# EAGLE design rs-485-multiplier-v2-x8 (EAGLE 8.7.0)
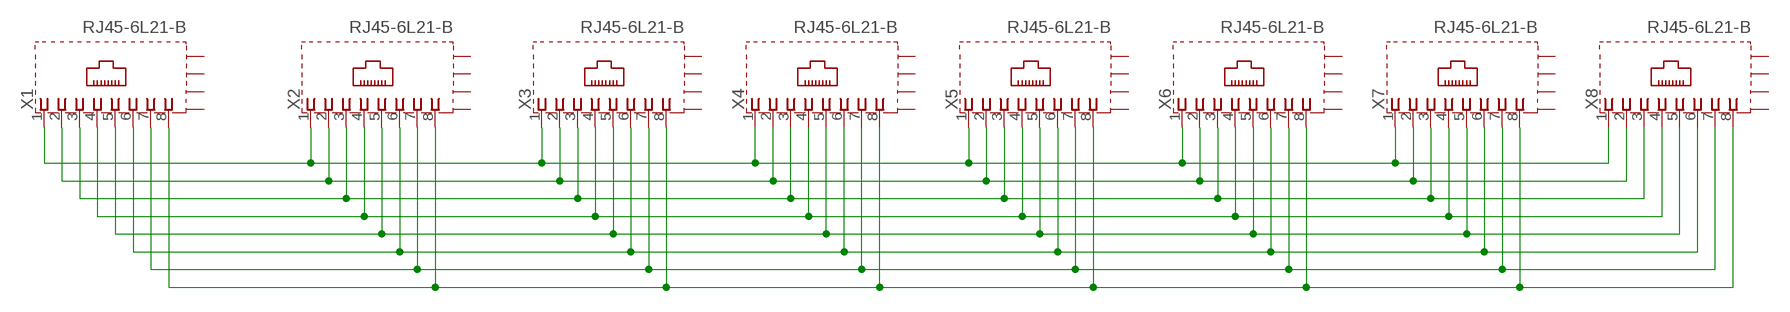
[diagram p0: schematic, sheet 1]

## Parts
X1  RJ45-6L21-B  [RJ45-SHIELD1]
X2  RJ45-6L21-B  [RJ45-SHIELD1]
X3  RJ45-6L21-B  [RJ45-SHIELD1]
X4  RJ45-6L21-B  [RJ45-SHIELD1]
X5  RJ45-6L21-B  [RJ45-SHIELD1]
X6  RJ45-6L21-B  [RJ45-SHIELD1]
X7  RJ45-6L21-B  [RJ45-SHIELD1]
X8  RJ45-6L21-B  [RJ45-SHIELD1]

## Nets
N$1: X1.1 X2.1 X3.1 X4.1 X5.1 X6.1 X7.1 X8.1
N$2: X1.2 X2.2 X3.2 X4.2 X5.2 X6.2 X7.2 X8.2
N$3: X1.3 X2.3 X3.3 X4.3 X5.3 X6.3 X7.3 X8.3
N$4: X1.4 X2.4 X3.4 X4.4 X5.4 X6.4 X7.4 X8.4
N$5: X1.5 X2.5 X3.5 X4.5 X5.5 X6.5 X7.5 X8.5
N$6: X1.6 X2.6 X3.6 X4.6 X5.6 X6.6 X7.6 X8.6
N$7: X1.7 X2.7 X3.7 X4.7 X5.7 X6.7 X7.7 X8.7
N$8: X1.8 X2.8 X3.8 X4.8 X5.8 X6.8 X7.8 X8.8
Unconnected: X1.S1(S) X1.S2(S) X1.S3(S) X1.S4(S) X2.S1(S) X2.S2(S) X2.S3(S) X2.S4(S) X3.S1(S) X3.S2(S) X3.S3(S) X3.S4(S) X4.S1(S) X4.S2(S) X4.S3(S) X4.S4(S) X5.S1(S) X5.S2(S) X5.S3(S) X5.S4(S) X6.S1(S) X6.S2(S) X6.S3(S) X6.S4(S) X7.S1(S) X7.S2(S) X7.S3(S) X7.S4(S) X8.S1(S) X8.S2(S) X8.S3(S) X8.S4(S)

## Library data of the parts
X1-X8 = con-tycoelectronics:RJ45*2: RJ45 Low Profile Shield Type 2 For all RJ45 L, LC, LCT and X Series Models Source: www.tycoelectronics.com .. ENG_DS_1654001_1099_RJ_L_0507.pdf; OC_FARNELL: unknown; OC_NEWARK: unknown

## Board
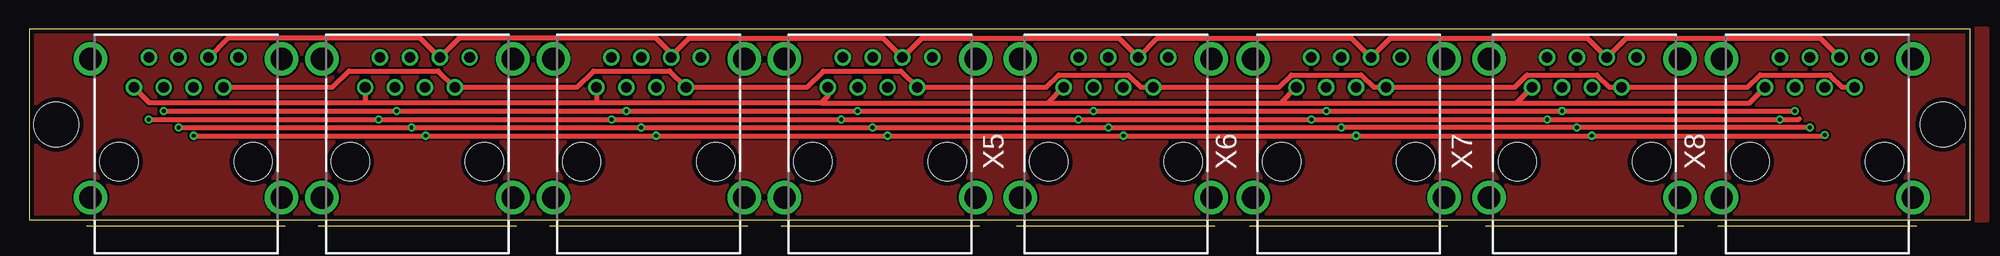
[diagram p1: board, top side]
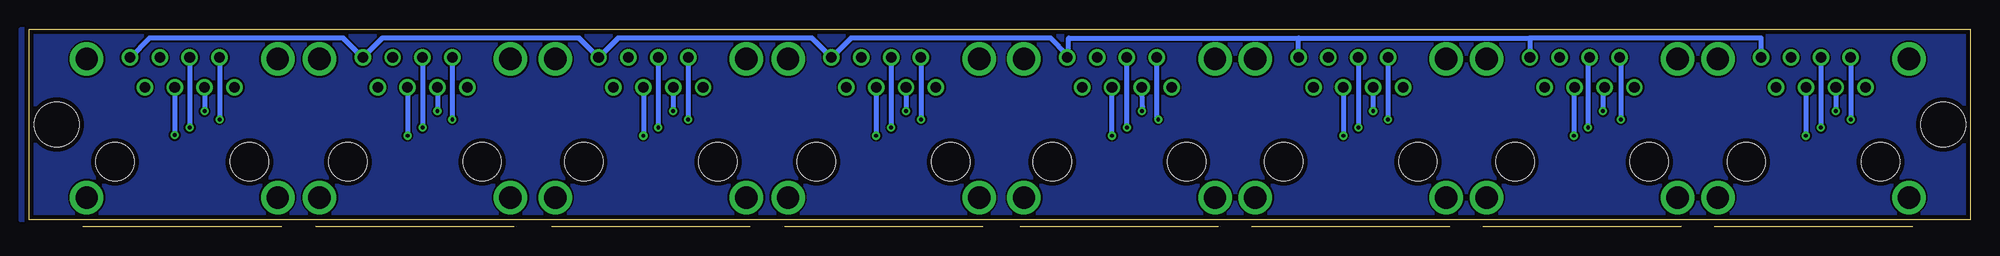
[diagram p2: board, bottom side, seen from below]

Size 165.15 x 16.25 mm. Coordinates in mm from the lower left corner, seen from the top.
Outline: 0,0 165.15,0 165.15,16.25 0,16.25 0,0
Copper layers (1*16): Top 0.0356mm / dielectric 1.5011mm / Bottom 0.0356mm
Design rules "LaenPCBOrder": minimum track width 6mil, minimum drill 13mil, track to track 6mil, track to pad 6mil, pad to pad 6mil, via to via 6mil, smd to smd 6mil, copper to edge 15mil, drill to drill 6mil, minimum pad ring 7mil, minimum via ring 7mil, stop-mask expansion 4mil, vias tented up to drill 0mil, thermal gap 10mil
Holes 3.81 mm at 2.29,8.13 162.81,8.13

### Footprints (pad centres in the part's own frame; a part is rotated, then mirrored left to right if it is on the bottom)
RJ45-SHIELD1 = drill 0.9 pad 1.4: 1 -4.445,6.35; 2 -3.175,8.89; 3 -1.905,6.35; 4 -0.635,8.89; 5 0.635,6.35; 6 1.905,8.89; 7 3.175,6.35; 8 4.445,8.89 | drill 1.9 pad 2.5: S1 -8.128,-3.048; S2 8.128,-3.048; S3 -8.128,8.76; S4 8.128,8.76 | hole 3.251: -5.715,0; 5.715,0

### Placement (x,y rotation side)
X1  72.39,4.95 0 top
X2  52.7,4.95 0 top
X3  33.02,4.95 0 top
X4  13.33,4.95 0 top
X5  92.46,4.95 0 top
X6  112.27,4.95 0 top
X7  132.33,4.95 0 top
X8  152.15,4.95 0 top

### Tracks (layer width: path | path; a pad name or v marks a point on that pad's centre or on a via)
GND
  pour Top: 0,16.26 0,0 166.62,0 166.62,16.26
  pour Bottom: 0,16.26 0,0 165.86,0 165.86,16.26
N$1
  Top 0.406: X1.1 67.95,10.54 67.37,9.97 | 67.37,9.97 48.26,9.97 | 48.26,9.97 28.45,9.97 | 28.45,9.97 10.22,9.97 X4.1 | X2.1 48.26,9.97 | X3.1 28.58,10.1 28.45,9.97 | 67.37,9.97 86.68,9.97 | 86.68,9.97 X5.1 | 86.68,9.97 106.49,9.97 | 106.49,9.97 X6.1 | 106.49,9.97 126.56,9.97 | 126.56,9.97 X7.1 | 126.56,9.97 146.37,9.97 X8.1
N$2  (via drill 0.33)
  Top 0.406: v10.16,8.57 v29.72,8.57 v49.53,8.57 v69.09,8.57 v89.28,8.57 v109.09,8.57 v129.16,8.57 v148.97,8.57 150.56,8.57 150.62,8.64
  Bottom 0.406: X4.2 v10.16,8.57 | v69.09,8.57 69.22,8.57 X1.2 | X3.2 29.72,13.84 v29.72,8.57 | X2.2 v49.53,8.57 | X5.2 89.28,8.64 89.22,8.57 v89.28,8.57 | X6.2 v109.09,8.57 | X8.2 v148.97,8.57 | X7.2 v129.16,8.57
N$3  (via drill 0.33)
  Top 0.406: v11.43,9.27 v31.24,9.27 v50.8,9.27 v70.48,9.27 v90.55,9.27 v110.36,9.27 v130.43,9.27 v150.24,9.27
  Bottom 0.406: X4.3 v11.43,9.27 | v70.48,9.27 70.42,9.65 X1.3 | X3.3 31.24,11.3 v31.24,9.27 | X2.3 v50.8,9.27 | X5.3 v90.55,9.27 | X6.3 v110.36,9.27 | X8.3 v150.24,9.27 | X7.3 v130.43,9.27
N$4  (via drill 0.33)
  Top 0.406: v12.7,7.87 v32.51,7.87 v52.07,7.87 v71.76,7.87 v91.82,7.87 v111.63,7.87 v131.7,7.87 v151.51,7.87
  Bottom 0.406: X4.4 v12.7,7.87 | v71.76,7.87 X1.4 | X3.4 32.51,13.84 v32.51,7.87 | X2.4 v52.07,7.87 | X5.4 v91.82,7.87 91.82,7.81 | X6.4 v111.63,7.87 | X8.4 v151.51,7.87 | X7.4 v131.7,7.87
N$5  (via drill 0.33)
  Top 0.406: v13.97,7.18 v33.72,7.18 v53.34,7.18 v73.03,7.18 v93.09,7.18 v112.9,7.18 v132.97,7.18 152.72,7.18 v152.78,7.24
  Bottom 0.406: X4.5 v13.97,7.18 | v73.03,7.18 X1.5 | X3.5 33.72,11.3 v33.72,7.18 | X2.5 v53.34,7.18 | X8.5 v152.78,7.24 | X5.5 v93.09,7.18 | X6.5 v112.9,7.18 | X7.5 v132.97,7.18
N$6
  Top 0.406: X4.6 16.89,15.49 33.27,15.49 X3.6 36.58,15.49 53.34,15.49 54.61,14.22 X2.6 54.61,13.97 56.13,15.49 72.64,15.49 X1.6 75.95,15.49 92.71,15.49 X5.6 96.01,15.49 112.52,15.49 X6.6 115.82,15.49 132.59,15.49 X7.6 135.89,15.49 152.4,15.49 X8.6
N$7
  Top 0.406: X4.7 25.78,11.3 27.18,12.7 34.8,12.7 X3.7 46.61,11.3 48.01,12.7 54.48,12.7 X2.7 66.17,11.3 67.56,12.7 74.17,12.7 X1.7 86.52,11.3 87.57,12.36 93.53,12.36 94.58,11.3 X5.7 106.33,11.3 107.39,12.36 113.34,12.36 114.4,11.3 X6.7 126.4,11.3 127.45,12.36 133.41,12.36 134.46,11.3 X7.7 146.21,11.3 147.26,12.36 153.22,12.36 154.27,11.3 X8.7
N$8
  Bottom 0.406: X4.8 17.78,15.49 37.46,15.49 | 37.46,15.49 X3.8 | X2.8 57.15,15.49 | 57.15,15.49 37.46,15.49 | 57.15,15.49 76.71,15.49 76.71,13.84 X1.8 76.84,14.1 78.23,15.49 95.25,15.49 X5.8 98.55,15.49 115.06,15.49 X6.8 118.36,15.49 135.13,15.49 X7.8 138.43,15.49 154.94,15.49 X8.8